# EAGLE design lm1117 out 5v (EAGLE 9.6.2)
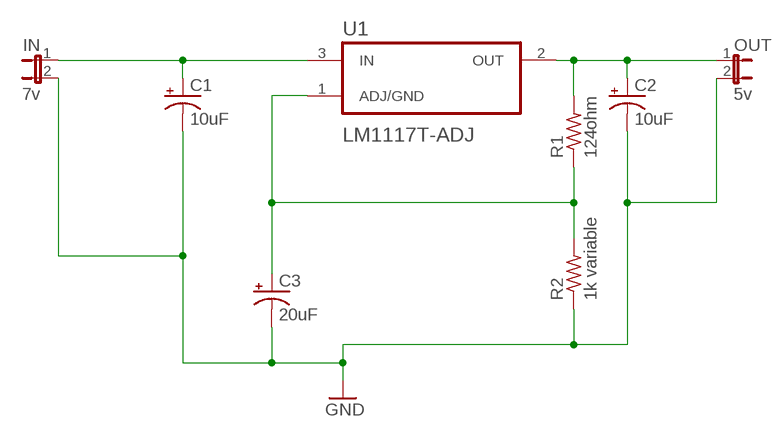
[diagram p0: schematic, sheet 1]

## Parts
C1  10uF  CPOL-USCT6032  [CT6032]
C2  10uF  CPOL-USCT6032  [CT6032]
C3  20uF  CPOL-USCT6032  [CT6032]
IN  7v  JP1E  [JP1]
OUT  5v  JP1E  [JP1]
R1  124ohm  R-US_0207/7  [0207/7]
R2  1k variable  R-US_0207/7  [0207/7]
U1  LM1117T-ADJ  [TO254P1054X470X1955-3]

## Nets
GND: C1.- C2.- C3.- IN.2 OUT.2 R2.1
N$1: C1.+ IN.1 U1.3(IN)
N$2: C2.+ OUT.1 R1.2 U1.2(OUT)
N$4: C3.+ R1.1 R2.2 U1.1(ADJ/GND)

## Library data of the parts
C1-C3 = rcl:CPOL-US: POLARIZED CAPACITOR, American symbol; SPICEPREFIX: C
IN OUT = jumper:JP1E: JUMPER
R1 R2 = rcl:R-US_: RESISTOR, American symbol; SPICEPREFIX: R
U1 = ASP_LM1117T-ADJ:LM1117T-ADJ: Check prices <https://pricing.snapeda.com/search/part/LM1117T-ADJ/NOPB/?ref=eda>; AVAILABILITY: Warning; DESCRIPTION: 800-mA 15-V linear voltage regulator 3-TO-220 0 to 125; MF: Texas Instruments; MP: LM1117T-ADJ/NOPB; PACKAGE: TO-220-3 Texas Instruments; PRICE: None; PURCHASE-URL: https://pricing.snapeda.com/search/part/LM1117T-ADJ/NOPB/?ref=eda

## Board
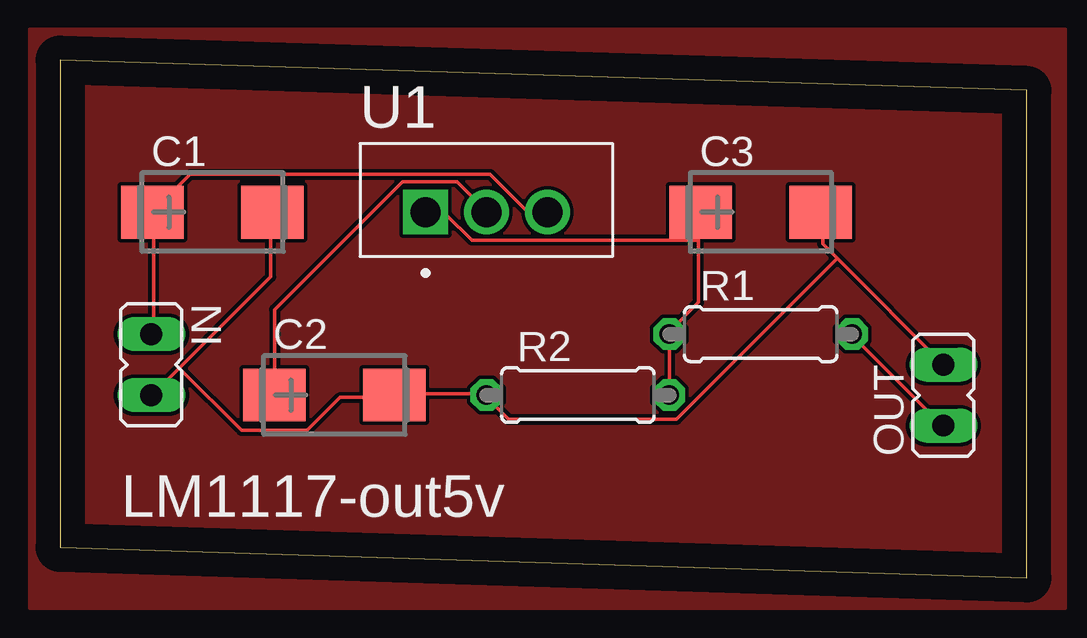
[diagram p1: board, top side]
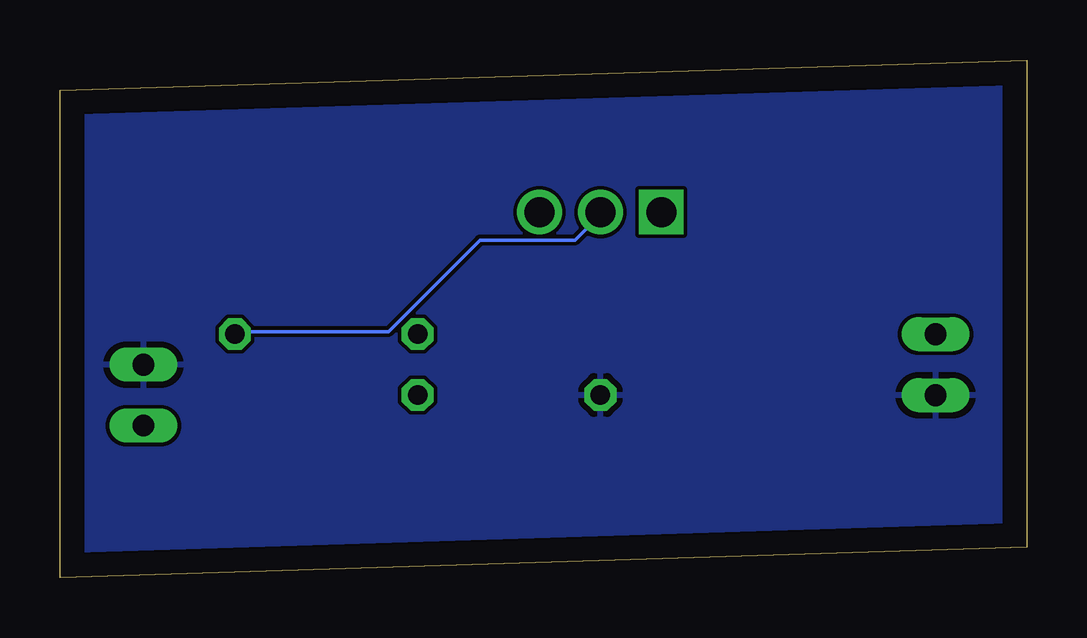
[diagram p2: board, bottom side, seen from below]

Size 40.31 x 21.58 mm. Coordinates in mm from the lower left corner, seen from the top.
Outline: 0,1.27 40.31,0 40.31,20.31 0,21.58 0,1.27
Copper layers (1*16): Top 0.035mm / dielectric 1.5mm / Bottom 0.035mm
Design rules "default": minimum track width 6mil, minimum drill 0.35mm, track to track 6mil, track to pad 6mil, pad to pad 6mil, via to via 6mil, smd to smd 6mil, copper to edge 40mil, drill to drill 6mil, minimum pad ring 10mil, minimum via ring 8mil, stop-mask expansion 4mil, vias tented up to drill 0mil, thermal gap 10mil

### Footprints (pad centres in the part's own frame; a part is rotated, then mirrored left to right if it is on the bottom)
CT6032 = smd 2.6 x 2.2: + -2.5,0; - 2.5,0
JP1 = drill 0.914 long: 1 0,-1.27; 2 0,1.27
0207/7 = drill 0.813 octagon: 1 -3.81,0; 2 3.81,0
TO254P1054X470X1955-3 = drill 1.24 square: 1 -2.54,0 | drill 1.24: 2 0,0; 3 2.54,0

### Placement (x,y rotation side)
C1  6.35,15.24 0 top
C2  11.43,7.62 0 top
C3  29.21,15.24 0 top
IN  3.81,8.89 180 top
OUT  36.83,7.62 0 top
R1  29.21,10.16 0 top
R2  21.59,7.62 0 top
U1  17.78,15.24 0 top

### Tracks (layer width: path | path; a pad name or v marks a point on that pad's centre or on a via)
GND
  Top 0.152: OUT.2 32.41,13.31 | 32.41,13.31 31.8,13.92 31.8,15.14 C3.- | 4.98,8.74 3.91,7.67 IN.2 | 4.98,8.74 8.79,12.55 8.79,15.14 C1.- | 4.98,8.74 7.57,6.15 10.31,6.15 11.68,7.52 13.82,7.52 C2.- 13.97,7.67 17.78,7.67 R2.1 17.78,7.52 18.69,6.6 25.71,6.6 32.41,13.31
  pour Bottom: -2.54,24.13 43.18,24.13 43.18,-2.54 -2.54,-2.54
N$1
  Top 0.152: IN.1 3.91,10.26 3.91,15.14 C1.+ 3.91,15.29 5.44,16.81 17.93,16.81 19.46,15.29 20.22,15.29 U1.3
N$2
  Top 0.152: R1.2 33.02,10.11 36.83,6.3 OUT.1 | C2.+ 8.94,7.67 8.94,11.18 14.28,16.51 16.56,16.51 17.78,15.29 U1.2
  Bottom 0.152: R1.2 33.02,10.26 26.62,10.26 22.81,14.07 18.85,14.07 17.78,15.14 U1.2
N$4
  Top 0.152: 26.62,14.07 26.62,11.48 25.4,10.26 R1.1 R2.2 | 26.62,14.07 26.62,15.14 C3.+ | 26.62,14.07 17.17,14.07 16.1,15.14 15.34,15.14 U1.1
TOP
  pour Top: -1.27,22.86 41.91,22.86 41.91,-1.27 -1.27,-1.27

### Text on the board
tPlace: LM1117-out5v